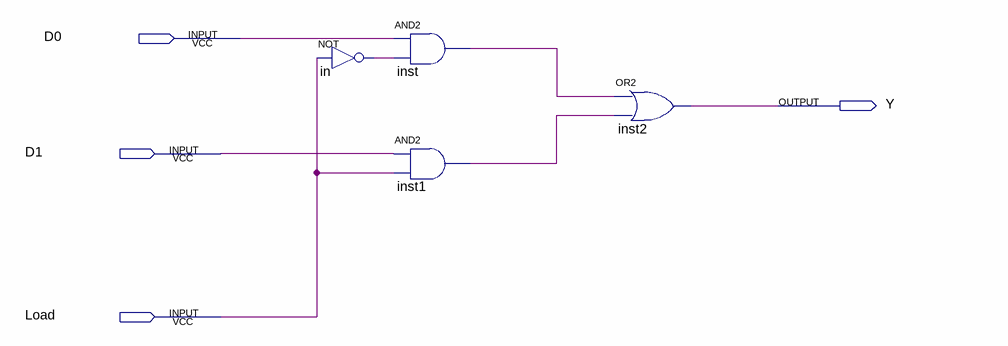
[diagram p0: schematic sheet]
// Quartus schematic mux.bdf as structural Verilog: 4 symbols, 4 pins
module mux (
  input  D0,
  input  D1,
  input  Load,
  output Y
);

  wire in_out, inst1_out, inst_out;

  not in (in_out, Load);
  and inst (inst_out, D0, in_out);
  and inst1 (inst1_out, D1, Load);
  or inst2 (Y, inst_out, inst1_out);
endmodule
